# Altium schematic sheet Dot.SchDoc
size A4
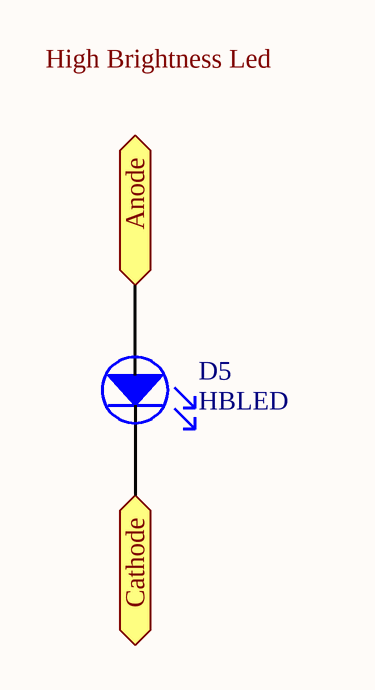
[diagram p0: Dot.SchDoc]

## Parts
D5  HBLED  [LED]

## Ports
Anode, Cathode

## Nets
Anode: D5.A(Anode) ; port Anode
Cathode: D5.K(Cathode) ; port Cathode

## Notes on the sheet
- Labels drawn without touching a wire or pin: High Brightness Led